# Altium schematic sheet stm32.SchDoc
size A3
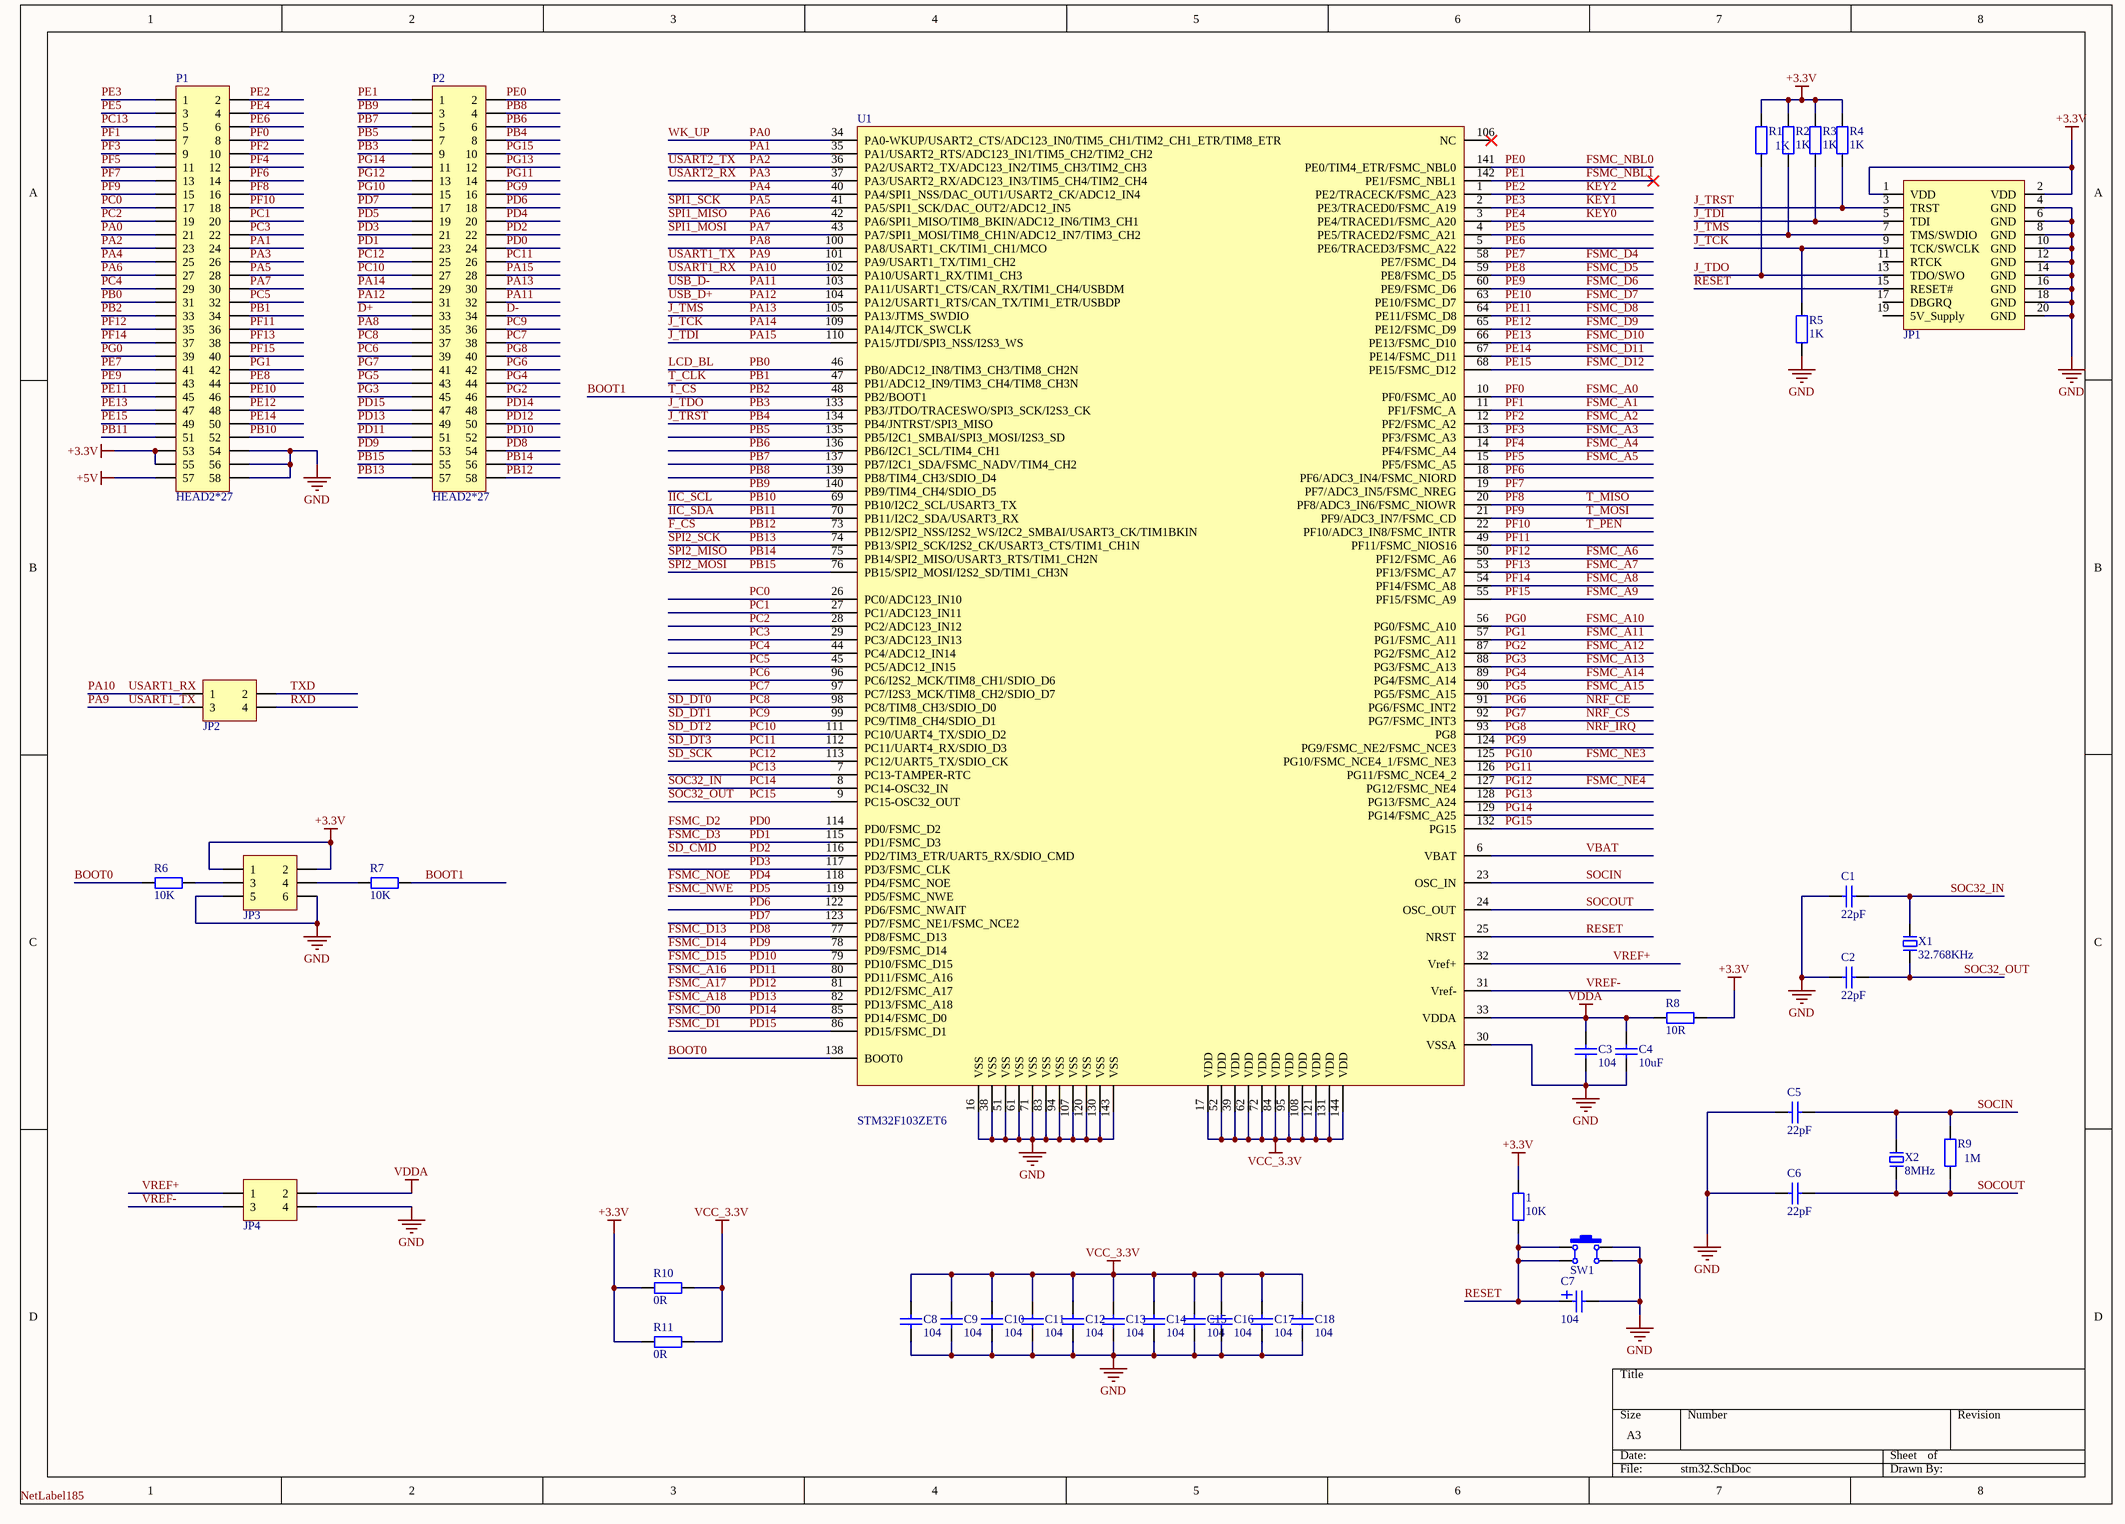
[diagram p0: stm32.SchDoc]

## Parts
1  10K  [R1206-HP_L]
C1  22pF  [1210]
C2  22pF  [1210]
C3  104  [1210]
C4  10uF  [1210]
C5  22pF  [1210]
C6  22pF  [1210]
C7  104  [1210]
C8  104  [1210]
C9  104  [1210]
C10  104  [1210]
C11  104  [1210]
C12  104  [1210]
C13  104  [1210]
C14  104  [1210]
C15  104  [1210]
C16  104  [1210]
C17  104  [1210]
C18  104  [1210]
JP1  Header 2X10  [HDR2.54-WI-2x10P]  (value not drawn)
JP2  Header2X2  [HDR2.54-LI-2x2P]  (value not drawn)
JP3  Header3X2  [HDR2.54-LI-2x3P]  (value not drawn)
JP4  Header2X2  [HDR2.54-LI-2x2P]  (value not drawn)
P1  HEAD2*27  [2*27HEADER]
P2  HEAD2*27  [2*27HEADER]
R1  1K  [R1206-HP_L]
R2  1K  [R1206-HP_L]
R3  1K  [R1206-HP_L]
R4  1K  [R1206-HP_L]
R5  1K  [R1206-HP_L]
R6  10K  [R1206-HP_L]
R7  10K  [R1206-HP_L]
R8  10R  [R1206-HP_L]
R9  1M  [R1206-HP_L]
R10  0R  [R1206-HP_L]
R11  0R  [R1206-HP_L]
SW1  4x4x1.5  [按键]  (value not drawn)
U1  STM32F103ZET6  [STM-LQFP144_V]
X1  32.768KHz  [Radial,2x6mm]
X2  8MHz  [HC-49S]

## Nets
+3.3V: 1.2 JP1.1(VDD) JP1.2(VDD) JP3.1 JP3.2 P1.53 P1.55 R1.2 R2.2 R3.2 R4.2 R8.2 R10.1 R11.1
+5V: P1.57
GND: C1.2 C2.2 C3.2 C4.2 C5.2 C6.2 C7.2 C8.1 C9.1 C10.1 C11.1 C12.1 C13.1 C14.1 C15.1 C16.1 C17.1 C18.1 JP1.4(GND) JP1.6(GND) JP1.8(GND) JP1.10(GND) JP1.12(GND) JP1.14(GND) JP1.16(GND) JP1.18(GND) JP1.20(GND) JP3.5 JP3.6 JP4.4 P1.54 P1.56 P1.58 R5.1 SW1.2 SW1.3 U1.16(VSS) U1.30(VSSA) U1.38(VSS) U1.51(VSS) U1.61(VSS) U1.71(VSS) U1.83(VSS) U1.94(VSS) U1.107(VSS) U1.120(VSS) U1.130(VSS) U1.143(VSS)
VCC_3.3V: C8.2 C9.2 C10.2 C11.2 C12.2 C13.2 C14.2 C15.2 C16.2 C17.2 C18.2 R10.2 R11.2 U1.17(VDD) U1.39(VDD) U1.52(VDD) U1.62(VDD) U1.72(VDD) U1.84(VDD) U1.95(VDD) U1.108(VDD) U1.121(VDD) U1.131(VDD) U1.144(VDD)
VDDA: C3.1 C4.1 JP4.2 R8.1 U1.33(VDDA)
BOOT0: R6.1 U1.138(BOOT0)
BOOT1: P1.33 R7.2 U1.48(PB2/BOOT1)  [also labelled PB2, T_CS]
D+: P2.33
D-: P2.34
F_CS: P2.58 U1.73(PB12/SPI2_NSS/I2S2_WS/I2C2_SMBAI/USART3_CK/TIM1BKIN)  [also labelled PB12]
FSMC_A0: P1.8 U1.10(PF0/FSMC_A0)  [also labelled PF0]
FSMC_A1: P1.7 U1.11(PF1/FSMC_A)  [also labelled PF1]
FSMC_A2: P1.10 U1.12(PF2/FSMC_A2)  [also labelled PF2]
FSMC_A3: P1.9 U1.13(PF3/FSMC_A3)  [also labelled PF3]
FSMC_A4: P1.12 U1.14(PF4/FSMC_A4)  [also labelled PF4]
FSMC_A5: P1.11 U1.15(PF5/FSMC_A5)  [also labelled PF5]
FSMC_A6: P1.35 U1.50(PF12/FSMC_A6)  [also labelled PF12]
FSMC_A7: P1.38 U1.53(PF13/FSMC_A7)  [also labelled PF13]
FSMC_A8: P1.37 U1.54(PF14/FSMC_A8)  [also labelled PF14]
FSMC_A9: P1.40 U1.55(PF15/FSMC_A9)  [also labelled PF15]
FSMC_A10: P1.39 U1.56(PG0/FSMC_A10)  [also labelled PG0]
FSMC_A11: P1.42 U1.57(PG1/FSMC_A11)  [also labelled PG1]
FSMC_A12: P2.46 U1.87(PG2/FSMC_A12)  [also labelled PG2]
FSMC_A13: P2.45 U1.88(PG3/FSMC_A13)  [also labelled PG3]
FSMC_A14: P2.44 U1.89(PG4/FSMC_A14)  [also labelled PG4]
FSMC_A15: P2.43 U1.90(PG5/FSMC_A15)  [also labelled PG5]
FSMC_A16: P2.51 U1.80(PD11/FSMC_A16)  [also labelled PD11]
FSMC_A17: P2.50 U1.81(PD12/FSMC_A17)  [also labelled PD12]
FSMC_A18: P2.49 U1.82(PD13/FSMC_A18)  [also labelled PD13]
FSMC_D0: P2.48 U1.85(PD14/FSMC_D0)  [also labelled PD14]
FSMC_D1: P2.47 U1.86(PD15/FSMC_D1)  [also labelled PD15]
FSMC_D2: P2.24 U1.114(PD0/FSMC_D2)  [also labelled PD0]
FSMC_D3: P2.23 U1.115(PD1/FSMC_D3)  [also labelled PD1]
FSMC_D4: P1.41 U1.58(PE7/FSMC_D4)  [also labelled PE7]
FSMC_D5: P1.44 U1.59(PE8/FSMC_D5)  [also labelled PE8]
FSMC_D6: P1.43 U1.60(PE9/FSMC_D6)  [also labelled PE9]
FSMC_D7: P1.46 U1.63(PE10/FSMC_D7)  [also labelled PE10]
FSMC_D8: P1.45 U1.64(PE11/FSMC_D8)  [also labelled PE11]
FSMC_D9: P1.48 U1.65(PE12/FSMC_D9)  [also labelled PE12]
FSMC_D10: P1.47 U1.66(PE13/FSMC_D10)  [also labelled PE13]
FSMC_D11: P1.50 U1.67(PE14/FSMC_D11)  [also labelled PE14]
FSMC_D12: P1.49 U1.68(PE15/FSMC_D12)  [also labelled PE15]
FSMC_D13: P2.54 U1.77(PD8/FSMC_D13)  [also labelled PD8]
FSMC_D14: P2.53 U1.78(PD9/FSMC_D14)  [also labelled PD9]
FSMC_D15: P2.52 U1.79(PD10/FSMC_D15)  [also labelled PD10]
FSMC_NBL0: P2.2 U1.141(PE0/TIM4_ETR/FSMC_NBL0)  [also labelled PE0]
FSMC_NBL1: P2.1 U1.142(PE1/FSMC_NBL1)  [also labelled PE1]
FSMC_NE3: P2.15 U1.125(PG10/FSMC_NCE4_1/FSMC_NE3)  [also labelled PG10]
FSMC_NE4: P2.13 U1.127(PG12/FSMC_NE4)  [also labelled PG12]
FSMC_NOE: P2.20 U1.118(PD4/FSMC_NOE)  [also labelled PD4]
FSMC_NWE: P2.19 U1.119(PD5/FSMC_NWE)  [also labelled PD5]
IIC_SCL: P1.52 U1.69(PB10/I2C2_SCL/USART3_TX)  [also labelled PB10]
IIC_SDA: P1.51 U1.70(PB11/I2C2_SDA/USART3_RX)  [also labelled PB11]
J_TCK: JP1.9(TCK/SWCLK) P2.29 R5.2 U1.109(PA14/JTCK_SWCLK)  [also labelled PA14]
J_TDI: JP1.5(TDI) P2.28 R3.1 U1.110(PA15/JTDI/SPI3_NSS/I2S3_WS)  [also labelled PA15]
J_TDO: JP1.13(TDO/SWO) P2.9 R1.1 U1.133(PB3/JTDO/TRACESWO/SPI3_SCK/I2S3_CK)  [also labelled PB3]
J_TMS: JP1.7(TMS/SWDIO) P2.30 R2.1 U1.105(PA13/JTMS_SWDIO)  [also labelled PA13]
J_TRST: JP1.3(TRST) P2.8 R4.1 U1.134(PB4/JNTRST/SPI3_MISO)  [also labelled PB4]
KEY0: P1.4 U1.3(PE4/TRACED1/FSMC_A20)  [also labelled PE4]
KEY1: P1.1 U1.2(PE3/TRACED0/FSMC_A19)  [also labelled PE3]
KEY2: P1.2 U1.1(PE2/TRACECK/FSMC_A23)  [also labelled PE2]
LCD_BL: P1.31 U1.46(PB0/ADC12_IN8/TIM3_CH3/TIM8_CH2N)  [also labelled PB0]
NRF_CE: P2.42 U1.91(PG6/FSMC_INT2)  [also labelled PG6]
NRF_CS: P2.41 U1.92(PG7/FSMC_INT3)  [also labelled PG7]
NRF_IRQ: P2.40 U1.93(PG8)  [also labelled PG8]
PA0: P1.21 U1.34(PA0-WKUP/USART2_CTS/ADC123_IN0/TIM5_CH1/TIM2_CH1_ETR/TIM8_ETR)  [also labelled WK_UP]
PA1: P1.24 U1.35(PA1/USART2_RTS/ADC123_IN1/TIM5_CH2/TIM2_CH2)
PA2: P1.23 U1.36(PA2/USART2_TX/ADC123_IN2/TIM5_CH3/TIM2_CH3)  [also labelled USART2_TX]
PA3: P1.26 U1.37(PA3/USART2_RX/ADC123_IN3/TIM5_CH4/TIM2_CH4)  [also labelled USART2_RX]
PA4: P1.25 U1.40(PA4/SPI1_NSS/DAC_OUT1/USART2_CK/ADC12_IN4)
PA5: P1.28 U1.41(PA5/SPI1_SCK/DAC_OUT2/ADC12_IN5)  [also labelled SPI1_SCK]
PA6: P1.27 U1.42(PA6/SPI1_MISO/TIM8_BKIN/ADC12_IN6/TIM3_CH1)  [also labelled SPI1_MISO]
PA7: P1.30 U1.43(PA7/SPI1_MOSI/TIM8_CH1N/ADC12_IN7/TIM3_CH2)  [also labelled SPI1_MOSI]
PA8: P2.35 U1.100(PA8/USART1_CK/TIM1_CH1/MCO)
PA9: JP2.3 U1.101(PA9/USART1_TX/TIM1_CH2)  [also labelled USART1_TX]
PA10: JP2.1 U1.102(PA10/USART1_RX/TIM1_CH3)  [also labelled USART1_RX]
PA11: P2.32 U1.103(PA11/USART1_CTS/CAN_RX/TIM1_CH4/USBDM)  [also labelled USB_D-]
PA12: P2.31 U1.104(PA12/USART1_RTS/CAN_TX/TIM1_ETR/USBDP)  [also labelled USB_D+]
PB1: P1.34 U1.47(PB1/ADC12_IN9/TIM3_CH4/TIM8_CH3N)  [also labelled T_CLK]
PB5: P2.7 U1.135(PB5/I2C1_SMBAI/SPI3_MOSI/I2S3_SD)
PB6: P2.6 U1.136(PB6/I2C1_SCL/TIM4_CH1)
PB7: P2.5 U1.137(PB7/I2C1_SDA/FSMC_NADV/TIM4_CH2)
PB8: P2.4 U1.139(PB8/TIM4_CH3/SDIO_D4)
PB9: P2.3 U1.140(PB9/TIM4_CH4/SDIO_D5)
PB13: P2.57 U1.74(PB13/SPI2_SCK/I2S2_CK/USART3_CTS/TIM1_CH1N)  [also labelled SPI2_SCK]
PB14: P2.56 U1.75(PB14/SPI2_MISO/USART3_RTS/TIM1_CH2N)  [also labelled SPI2_MISO]
PB15: P2.55 U1.76(PB15/SPI2_MOSI/I2S2_SD/TIM1_CH3N)  [also labelled SPI2_MOSI]
PC0: P1.17 U1.26(PC0/ADC123_IN10)
PC1: P1.20 U1.27(PC1/ADC123_IN11)
PC2: P1.19 U1.28(PC2/ADC123_IN12)
PC3: P1.22 U1.29(PC3/ADC123_IN13)
PC4: P1.29 U1.44(PC4/ADC12_IN14)
PC5: P1.32 U1.45(PC5/ADC12_IN15)
PC6: P2.39 U1.96(PC6/I2S2_MCK/TIM8_CH1/SDIO_D6)
PC7: P2.38 U1.97(PC7/I2S3_MCK/TIM8_CH2/SDIO_D7)
PC8: P2.37 U1.98(PC8/TIM8_CH3/SDIO_D0)  [also labelled SD_DT0]
PC9: P2.36 U1.99(PC9/TIM8_CH4/SDIO_D1)  [also labelled SD_DT1]
PC10: P2.27 U1.111(PC10/UART4_TX/SDIO_D2)  [also labelled SD_DT2]
PC11: P2.26 U1.112(PC11/UART4_RX/SDIO_D3)  [also labelled SD_DT3]
PC12: P2.25 U1.113(PC12/UART5_TX/SDIO_CK)  [also labelled SD_SCK]
PC13: P1.5 U1.7(PC13-TAMPER-RTC)
PC14: C1.1 U1.8(PC14-OSC32_IN) X1.2  [also labelled SOC32_IN]
PC15: C2.1 U1.9(PC15-OSC32_OUT) X1.1  [also labelled SOC32_OUT]
PD2: P2.22 U1.116(PD2/TIM3_ETR/UART5_RX/SDIO_CMD)  [also labelled SD_CMD]
PD3: P2.21 U1.117(PD3/FSMC_CLK)
PD6: P2.18 U1.122(PD6/FSMC_NWAIT)
PD7: P2.17 U1.123(PD7/FSMC_NE1/FSMC_NCE2)
PE5: P1.3 U1.4(PE5/TRACED2/FSMC_A21)
PE6: P1.6 U1.5(PE6/TRACED3/FSMC_A22)
PF6: P1.14 U1.18(PF6/ADC3_IN4/FSMC_NIORD)
PF7: P1.13 U1.19(PF7/ADC3_IN5/FSMC_NREG)
PF8: P1.16 U1.20(PF8/ADC3_IN6/FSMC_NIOWR)  [also labelled T_MISO]
PF9: P1.15 U1.21(PF9/ADC3_IN7/FSMC_CD)  [also labelled T_MOSI]
PF10: P1.18 U1.22(PF10/ADC3_IN8/FSMC_INTR)  [also labelled T_PEN]
PF11: P1.36 U1.49(PF11/FSMC_NIOS16)
PG9: P2.16 U1.124(PG9/FSMC_NE2/FSMC_NCE3)
PG11: P2.14 U1.126(PG11/FSMC_NCE4_2)
PG13: P2.12 U1.128(PG13/FSMC_A24)
PG14: P2.11 U1.129(PG14/FSMC_A25)
PG15: P2.10 U1.132(PG15)
RESET: 1.1 C7.1 JP1.15(RESET#) SW1.1 SW1.4 U1.25(NRST)
RXD: JP2.4
SOCIN: C5.1 R9.2 U1.23(OSC_IN) X2.2
SOCOUT: C6.1 R9.1 U1.24(OSC_OUT) X2.1
TXD: JP2.2
VBAT: U1.6(VBAT)
VREF+: JP4.1 U1.32(Vref+)
VREF-: JP4.3 U1.31(Vref-)
NetJP3_3: JP3.3 R6.2
NetJP3_4: JP3.4 R7.1

Not connected (* = marked no-connect by the designer): JP1 11(RTCK) 17(DBGRQ) 19(5V_Supply); U1 106(NC)*

## Notes on the sheet
- Labels drawn without touching a wire or pin: NetLabel185

## Library data of the parts
1 R1-R11 = R: 贴片电阻; 联系卖家，免费查找封装: 唯一出售店铺网址https://shop463601444.taobao.com; 封装库来自淘宝卖家ID：黄晶宝石: 其他店铺购入均为盗版假冒封装库，请立即申请退款; BOM名称: 贴片电阻
C1-C6 C8-C18 = C: 贴片电容; BOM名称: 无极性贴片电容; 联系卖家，免费查找封装: 唯一出售店铺网址https://shop463601444.taobao.com; 封装库来自淘宝卖家ID：黄晶宝石: 其他店铺购入均为盗版假冒封装库，请立即申请退款
C7 = C2
JP1 = JTAG: 10*2P接插件
JP2 JP4 = Header 2X2: 2*2P接插件
JP3 = Header 3X2: 3*2P接插件; 封装库来自淘宝卖家 ID：黄晶宝石: 其他店铺购入均为盗版假冒封装库; 联系卖家，免费查找封装: 唯一出售店铺网址https://shop463601444.taobao.com; BOM名称: 3*2P接插件
SW1 = TSW SMD-4x4: 贴片4x4轻触开关; 联系卖家，免费查找封装: 唯一出售店铺网址https://shop463601444.taobao.com; BOM名称: 贴片4x4轻触开关
U1 = STM32F103ZET6: stm32zet6
X1 X2 = XTAL-2P: 2脚无源脚晶振; 联系卖家，免费查找封装: 唯一出售店铺网址https://shop463601444.taobao.com; BOM名称: 2脚无源脚晶振